# Altium schematic sheet PowerDACSUB (2).SchDoc
size Legal; SheetNumber: 2; SheetTotal: 5
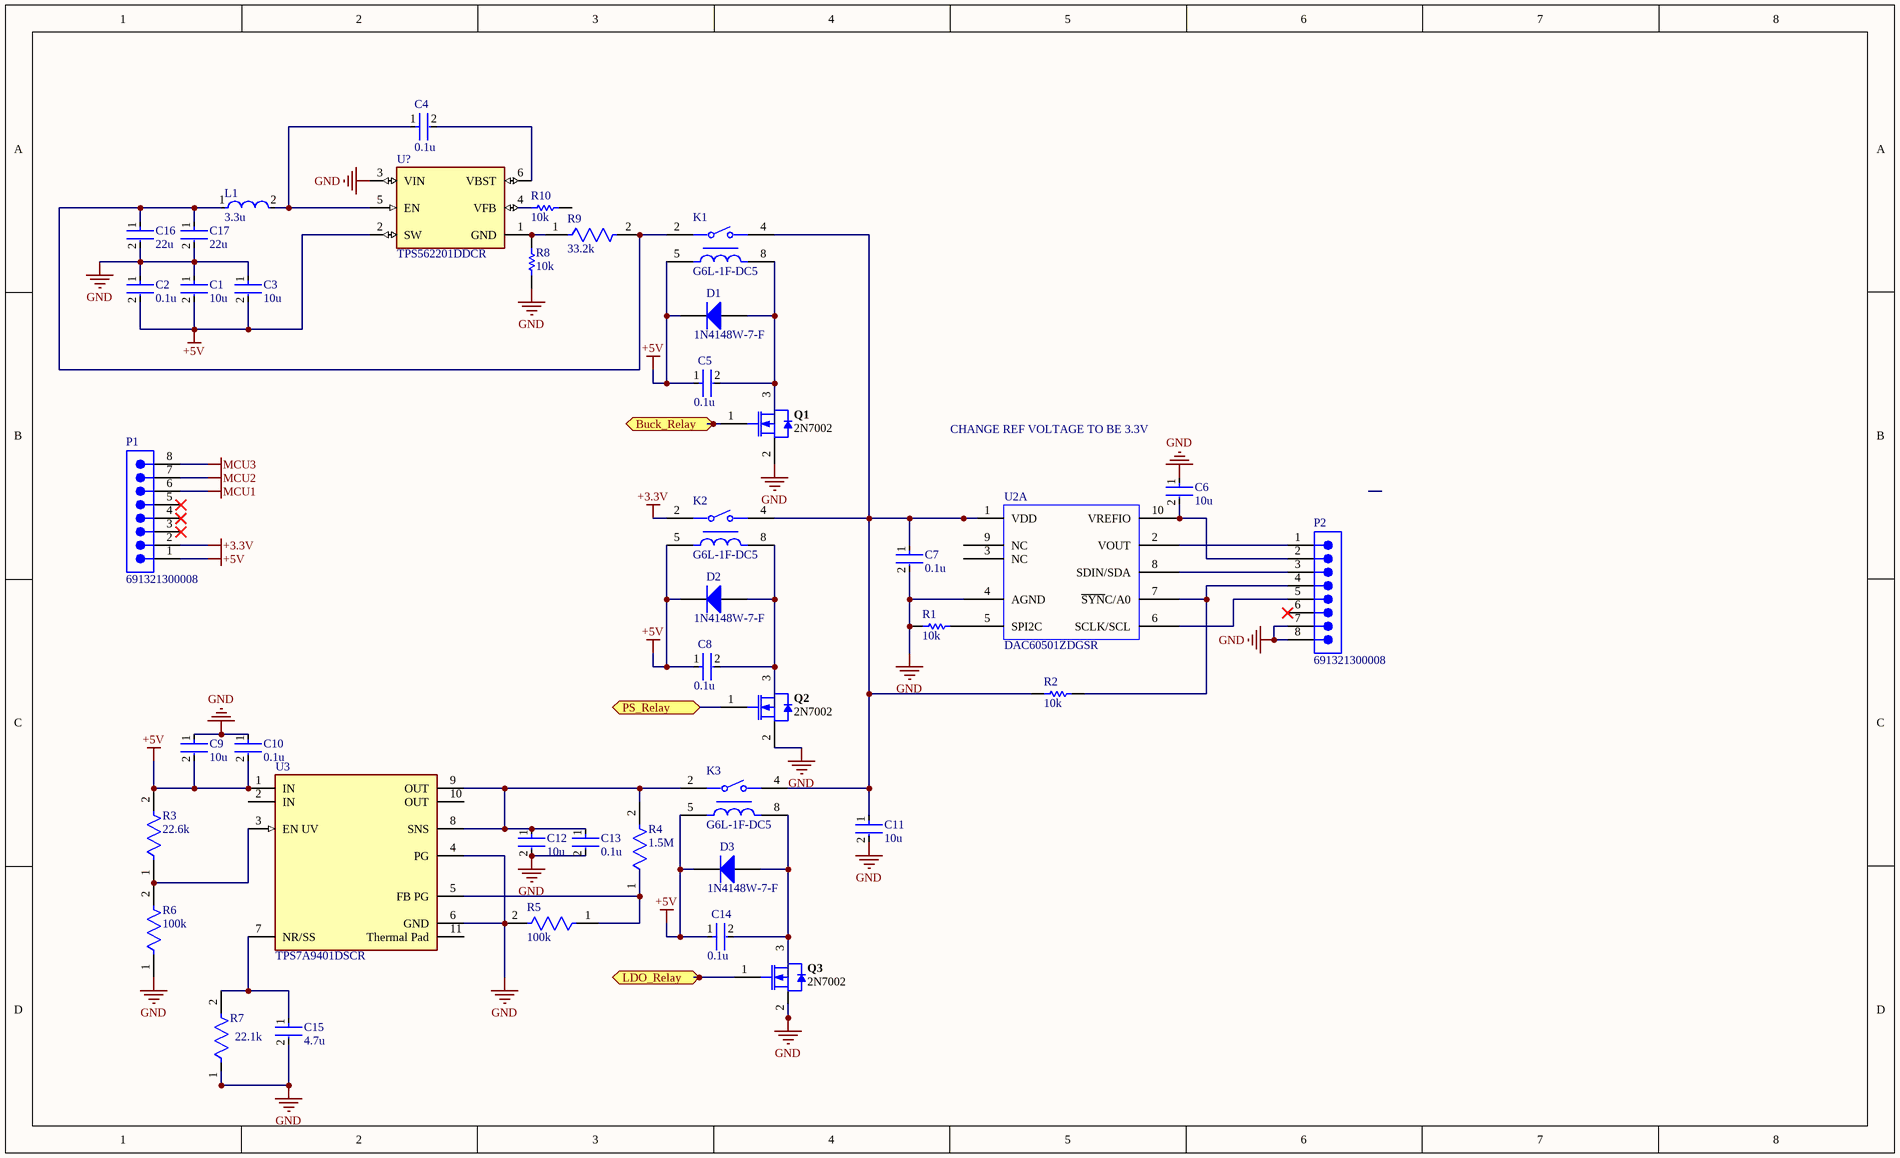
[diagram p0: PowerDACSUB (2).SchDoc]

## Parts
C1  10u  [FP-CL21-IPC_A]
C2  0.1u  [FP-CC0805-0_85-MFG]
C3  10u  [FP-CL21-IPC_A]
C4  0.1u  [FP-CC0805-0_85-MFG]
C5  0.1u  [FP-CC0805-0_85-MFG]
C6  10u  [FP-CL21-IPC_A]
C7  0.1u  [FP-CC0805-0_85-MFG]
C8  0.1u  [FP-CC0805-0_85-MFG]
C9  10u  [FP-CL21-IPC_A]
C10  0.1u  [FP-CC0805-0_85-MFG]
C11  10u  [FP-CL21-IPC_C]
C12  10u  [FP-CL21-IPC_A]
C13  0.1u  [FP-CC0805-0_85-MFG]
C14  0.1u  [FP-CC0805-0_85-MFG]
C15  4.7u  [FP-CL21-IPC_A]
C16  22u  [FP-CL32-IPC_C]
C17  22u  [FP-CL32-IPC_C]
D1  1N4148W-7-F  [DIOD-SOD123-2_V]
D2  1N4148W-7-F  [DIOD-SOD123-2_V]
D3  1N4148W-7-F  [DIOD-SOD123-2_V]
K1  G6L-1F-DC5  [FP-G6L-1F-DC5-MFG]
K2  G6L-1F-DC5  [FP-G6L-1F-DC5-MFG]
K3  G6L-1F-DC5  [FP-G6L-1F-DC5-MFG]
L1  3.3u  [FP-NR4018-MFG]
P1  691321300008  [691321300008]
P2  691321300008  [691321300008]
Q1  2N7002  [INF-PG-SOT23_M]
Q2  2N7002  [INF-PG-SOT23_M]
Q3  2N7002  [INF-PG-SOT23_M]
R1  10k  [RESC1609X50X30ML10T20]
R2  10k  [RESC1609X50X30ML10T20]
R3  22.6k  [FP-RT0805-MFG]
R4  1.5M  [FP-MCR03-IPC_B]
R5  100k  [FP-RK73H1J-IPC_C]
R6  100k  [FP-RK73H1J-IPC_C]
R7  22.1k  [FP-CRCW0805-e3-IPC_C]
R8  10k  [RESC1609X50X30ML10T20]
R9  33.2k  [FP-CR0805-IPC_C]
R10  10k  [RESC1609X50X30ML10T20]
U2  DAC60501ZDGSR  [DAC60501ZDSGR]  (part A of 2)
U3  TPS7A9401DSCR  [FP-DSC0010J-MFG]
U?  TPS562201DDCR  [FP-DDC0006A-IPC_C]

## Ports
Buck_Relay (bidir), LDO_Relay (bidir), PS_Relay (bidir)

## Nets
+3.3V: K2.2 P1.2
+5V: C1.2 C2.2 C3.2 C5.1 C8.1 C9.2 C10.2 C14.1 D1.2(K) D2.2(K) D3.2(K) K1.5 K2.5 K3.5 P1.1 R3.2 U3.1(IN) U?.2(SW)
GND: C1.1 C2.1 C3.1 C6.1 C7.2 C9.1 C10.1 C11.2 C12.2 C13.2 C15.2 C16.2 C17.2 P2.7 P2.8 Q1.2(SOURCE) Q2.2(SOURCE) Q3.2(SOURCE) R1.1 R5.2 R6.1 R7.1 R8.1 U2.4(AGND) U3.4(PG) U3.6(GND) U?.3(VIN)
MCU1: P1.6
MCU2: P1.7
MCU3: P1.8
Buck_Relay: Q1.1(GATE) ; port Buck_Relay
LDO_Relay: Q3.1(GATE) ; port LDO_Relay
PS_Relay: Q2.1(GATE) ; port PS_Relay
NetC4_1: C4.1 L1.2 U?.5(EN)
NetC4_2: C4.2 U?.6(VBST)
NetC5_2: C5.2 D1.1(A) K1.8 Q1.3(DRAIN)
NetC6_2: C6.2 P2.2 U2.10(VREFIO)
NetC7_1: C7.1 C11.1 K1.4 K2.4 K3.4 R2.1 U2.1(VDD)
NetC8_2: C8.2 D2.1(A) K2.8 Q2.3(DRAIN)
NetC12_1: C12.1 C13.1 K3.2 R4.2 U3.8(SNS) U3.9(OUT)
NetC14_2: C14.2 D3.1(A) K3.8 Q3.3(DRAIN)
NetC15_1: C15.1 R7.2 U3.7(NR/SS)
NetC16_1: C16.1 C17.1 K1.2 L1.1 R9.2
NetP2_1: P2.1 U2.2(VOUT)
NetP2_3: P2.3 U2.8(SDIN/SDA)
NetP2_4: P2.4 R2.2 U2.7(~{SYN}C/A0)
NetP2_5: P2.5 U2.6(SCLK/SCL)
NetR1_2: R1.2 U2.5(SPI2C)
NetR3_1: R3.1 R6.2 U3.3(EN_UV)
NetR4_1: R4.1 R5.1 U3.5(FB_PG)
NetR8_2: R8.2 R9.1 U?.1(GND)
NetR10_2: R10.2 U?.4(VFB)

Not connected (* = marked no-connect by the designer): P1 3* 4* 5*; P2 6*; R10 1; U2 3(NC) 9(NC); U3 2(IN) 10(OUT) 11(Thermal_Pad)

## Notes on the sheet
- CHANGE REF VOLTAGE TO BE 3.3V

## Library data of the parts
C1 C3 C6 C9 C12 = CMP-13271-002172-1: CL21 Series 0805 10uF 25V ±10% Tolerance X5R Multilayer Ceramic Chip Capacitor; Width: 0.049inch; Voltage Rating: 25V; Case/Package: 0805; Case Code (Imperial): 0805; Depth: 1.25mm; Capacitance: 10uF; Dielectric: X5R; Height: 0.85mm; Radiation Hardening: No; Thickness: 0.037inch; Length: 2mm; Packaging: Tape and Reel; Min Operating Temperature: -55°C; Case Code (Metric): 2012; Lead Free: Lead Free; Mount: Surface Mount; Package Quantity: 1; Tolerance: 10%; Max Operating Temperature: 85°C
C2 C4 C5 C8 C14 = CMP-2100-03606-3: Manufacturer Part Number: CC0805KRX7R9BB104; Manufacturer: Yageo; Tolerance: 0.1; Capacitance: 100 nF; Value: 100 nF; Temperature Characteristic: X7R; Voltage Rating: 50 V; Material: Ceramic; Device Class L1: Passive Components; ComponentLink2Description: Datasheet; Package: CC0805-0.85; Digikey Description: CAP CER 0.1UF 50V X7R 0805; Device Class L3: Ceramic Capacitors; Temperature: -30°C to +85°C; Height: 0.95mm; RoHS: TRUE; Ipc Land Pattern Name: CAPC200125X85; Device Class L2: Capacitors; Category: Cap; Temperature Range Low: -30°C; Temperature Range High: +85°C; Mouser Description: Multilayer Ceramic Capacitors MLCC - SMD/SMT 100nF 50V X7R 10%; Footprint Url: http://www.yageo.com/exep/pages/download/literatures/UPY-C_GEN_24.pdf; Automotive: No; Octopart: https://octopart.com/cc0805krx7r9bb104-yageo-192993; Lead Free: Yes; ComponentLink2URL: http://www.yageo.com/documents/recent/UPY-GPHC_Y5V_6.3V-to-50V_8.pdf
C7 C10 C13 = CMP-2100-03606-3: CAP CER 0.1UF 50V X7R 0805; Manufacturer Part Number: CC0805KRX7R9BB104; Manufacturer: Yageo; Tolerance: 0.1; Capacitance: 100 nF; Value: 100 nF; Material: Ceramic; Device Class L1: Passive Components; ComponentLink2Description: Datasheet; Package: CC0805-0.85; Digikey Description: CAP CER 0.1UF 50V X7R 0805; Device Class L3: Ceramic Capacitors; Temperature: -30°C to +85°C; Temperature Characteristic: X7R; Voltage Rating: 50 V; Height: 0.95mm; RoHS: TRUE; Ipc Land Pattern Name: CAPC200125X85; Device Class L2: Capacitors; Category: Cap; Temperature Range Low: -30°C; Temperature Range High: +85°C; Mouser Description: Multilayer Ceramic Capacitors MLCC - SMD/SMT 100nF 50V X7R 10%; Footprint Url: http://www.yageo.com/exep/pages/download/literatures/UPY-C_GEN_24.pdf; Automotive: No; Octopart: https://octopart.com/cc0805krx7r9bb104-yageo-192993; Lead Free: Yes; ComponentLink2URL: http://www.yageo.com/documents/recent/UPY-GPHC_Y5V_6.3V-to-50V_8.pdf
C11 = CMP-13271-002245-1: CL21 Series 0805 10uF 10V ±20% Tolerance X5R Multilayer Ceramic Chip Capacitor; Voltage Rating (DC): 10V; Mount: Surface Mount; Tolerance: 20%; Case/Package: 0805; Voltage Rating: 10V; Dielectric: X5R; Max Operating Temperature: 85°C; Packaging: Tape and Reel; Capacitance: 10uF; Height: 1.25mm; Thickness: 0.053inch; Width: 0.049inch; Length: 2mm; Radiation Hardening: No; Min Operating Temperature: -55°C; Depth: 1.25mm; Package Quantity: 10000
C15 = CMP-13271-002624-1: CL21 Series 0805 4.7uF 25V ±10% Tolerance X5R Multilayer Ceramic Chip Capacitor; Case Code (Imperial): 0805; Thickness: 0.055inch; Mount: Surface Mount; Case Code (Metric): 2012; Capacitance: 4.7uF; Depth: 1.25mm; Lead Free: Lead Free; Case/Package: 0805; Voltage Rating: 25V; Package Quantity: 1; Width: 0.049inch; Radiation Hardening: No; Voltage Rating (DC): 25V; Length: 2mm; Dielectric: X5R; Height: 1.25mm; Packaging: Tape and Reel; Tolerance: 10%; Min Operating Temperature: -55°C; Max Operating Temperature: 85°C
C16 C17 = CMP-13271-003500-1: Cap Ceramic 22uF 16V X7R ±10% SMD 1210 +125°C Embossed T/R; Voltage: 10V; Lead Free: Lead Free; Max Operating Temperature: 125°C; Width: 0.098inch; Min Operating Temperature: -55°C; Height: 2.5mm; Tolerance: 10%; Voltage Rating (DC): 16V; Radiation Hardening: No; Case Code (Imperial): 1210; Thickness: 0.106inch; Material: Ceramic; Capacitance: 22uF; Package Quantity: 1; Length: 3.2mm; Depth: 2.5mm; Case/Package: 1210; Voltage Rating: 16V; Mount: Surface Mount; Case Code (Metric): 3225; Packaging: Tape and Reel; Dielectric: X7R
D1-D3 = CMP-2000-04932-2: Fast Switching Diode, 100 V, 0.15 A, -65 to 150 degC, 2-Pin?SOD123, RoHS, Tape and Reel; Recovery Time: 4ns; Brand: DiodesIncorporated; Unit Weight: 0.000353oz; Max Surge Current: 2A; Peak Reverse Voltage: 100V; Ir - Reverse Current: 1uA; Vf - Forward Voltage: 1.25V; Configuration: Single; If - Forward Current: 0.15A; Product Category: Diodes-GeneralPurpose,Power,Switching; Operating Temperature Range: -65Cto+150C; Packaging: Reel; Manufacturer URL: http://www.diodes.com/; Maximum Operating Temperature: +150C; Height: 1.25mm; Minimum Operating Temperature: -65C; Product: SwitchingDiodes; Package URL: http://www.diodes.com/datasheets/ds18004.pdf; Type: SwitchingDiode; Package Reference: SOD123-2; Width: 1.7mm; Datasheet URL: http://www.farnell.com/datasheets/1915529.pdf; Datasheet Version: Rev. 24-2, 10/2013; Series: 1N4148; Factory Pack Quantity: 3000; Length: 2.85mm; RoHS: True; Manufacturer: DiodesIncorporated; Mounting Style: SMD/SMT; Package / Case: SOD-123
K1-K3 = CMP-08823-000020-1: RELAY TELECOM SPST 1A 5VDC; Manufacturer: Omron; Standoff Height: 0.4mm; Throw Configuration: SPST-NO; Coil Type: Non-Latching; Coil Current: 36mA; Coil Resistance: 139Ω; Number Of Contacts: 1; Coil Voltage: 5V; Coil Power: 180mW; Device Class L3: Signal Relays; Automotive: No; ComponentLink2URL: https://media.digikey.com/pdf/Data%20Sheets/Omron%20PDFs/G6L.pdf; Ambient Temperature Range High: +70°C; Mouser Description: Low Signal Relays - PCB LO PROF SPST 5VDC; RoHS: TRUE; Temperature Range High: +70°C; Height: 4.4mm; Device Class L1: Electromechanical; Lead Free: Yes; Temperature: -40°C to +70°C; Device Class L2: Relays; Manufacturer Part Number: G6L-1F-DC5; Temperature Range Low: -40°C; Category: Relay; Octopart: https://octopart.com/g6l-1f+dc5-omron-18903080; Ambient Temperature Range Low: -40°C; Current Rating: 1A; Package: G6L-1F-DC5; Digikey Description: RELAY TELECOM SPST 1A 5VDC; ComponentLink2Description: Datasheet
L1 = CMP-14484-000015-2: SMD Power Inductors 3.3uH ±20% 2A 66mΩ; Self Resonant Frequency: 45MHz; Saturation Current: 2.3A; Test Frequency: 100kHz; DC Resistance (DCR): 66mR; Shielding: Shielded; Core Material: Ferrite; Packaging: Tape and Reel; Resistor Type: Wirewound; Inductance Tolerance: 20%; Width: 0.157inch; Depth: 4.2mm; Lead Pitch: 2.8mm; RoHS Compliant: Yes; Max DC Current: 2.3A; Inductance: 3.3uH; Lead Free: Lead Free; Radiation Hardening: No; Halogen Free: Halogen Free; Termination: SMD/SMT; Height: 1.8mm; Number of Pins: 2; Case/Package: Nonstandard; Mount: Surface Mount; Tolerance: 20%; Max Operating Temperature: 125°C; Height - Seated (Max): 0.071inch; RMS Current (Irms): 2A; Length: 4mm; Series: NRS; Min Operating Temperature: -25°C; Package Quantity: 3500; Current Rating: 2A
P1 P2 = CMP-1502-01869-2: NexarPartId: 8917776; Number of Levels: 1; Voltage: 300V; Gender: Male; Number of Positions Per Level: 8; Pitch: 3.81mm; Current: 20A; Orientation: Vertical; Width: 35.38mm; Number of Pins: 8; Color: Green; Lead Pitch: 3.81mm; Termination: Solder; Contact Material: Brass; REACH SVHC: Unknown; RoHS: Compliant; Mount: Through Hole; Contact Plating: Tin; Length: 7mm; Number of Rows: 1; Number of Contacts: 8; Packaging: Box; Height: 12.7mm
Q1-Q3 = CMP-1149-00026-1: N-Channel OptiMOS Small-Signal-Transistor, 60 V VDS, 0.3 A ID, -55 to 150 degC, PG-SOT23, Reel, Green; Manufacturer: Infineon; RDS (on) (max) (@4.5V): 4,000 mOhm; VDS (max): 60 V; IDpuls (max): 1.2Â A; QG: 0.4Â nC; RDS (on) (max): 3,000 mOhm; RthJA (max): 250 K/W; ID (max): 0.3Â A; VGS(th) (max): 2.5Â V; VGS(th) (min): 1.5Â V; Green: TRUE; Ptot (max): 0.5Â W; PackageDescription: 3-Pin Small Outline Transistor Package, 2.9 x 1.3 mm Body, 0.95 mm Pitch; Halogen-free: TRUE; ComponentLink2Description: Datasheet; ComponentLink1URL: http://www.infineon.com/; Packing: Reel; DatasheetVersion: Rev. 2.4; PartNumber: 2N7002; PackageReference: PG-SOT23; PackageVersion: Apr-08; ComponentLink3URL: http://www.infineon.com/dgdl/SOT23-Package_Overview.pdf?folderId=db3a30431936bc4b0119532290053c66&fileId=db3a30431936bc4b0119533468123c85; ComponentLink1Description: Manufacturer URL; Mounting Technology: Surface Mount; ComponentLink3Description: Package Specification; ComponentLink2URL: http://www.infineon.com/dgdl/2N7002_Rev2.4.pdf?folderId=db3a3043156fd573011622e10b5c1f67&fileId=db3a304319bc939a0119c2a9461e79e6
R1 R2 R8 R10 = CMP-2000-03837-1: Manufacturer: Vishay Dale; Part Number: CRCW060310K0FKTB
R3 = CMP-2001-01789-2: RES SMD 22.6K OHM 1% 1/8W 0805; Manufacturer: Yageo; Manufacturer Part Number: RT0805FRE0722K6L; Power Rating: 0.125W; Tolerance: 0.0001; Voltage Rating: 150V; Value: 22.6KΩ; Temperature Coefficient: 50 ppm/°C; Device Class L3: Chip SMD Resistors; Octopart: https://octopart.com/rt0805fre0722k6l-yageo-1479006; Series: RT; Lead Free: Yes; Digikey Description: RES SMD 22.6K OHM 1% 1/8W 0805; Automotive: No; Ipc Land Pattern Name: RESC200125X50; RoHS: TRUE; Category: Res; ComponentLink2Description: Datasheet; Composition: Thin Film; Device Class L2: Resistors; Temperature: -55°C to +155°C; Resistance: 22.6KΩ; Temperature Range High: +155°C; Device Class L1: Passive Components; Mouser Description: Thin Film Resistors - SMD 1/8W 22.6K ohm 1% 50ppm; Temperature Range Low: -55°C; Package: RT0805; Height: 0.6mm; Footprint Url: http://www.yageo.com/exep/pages/download/literatures/PYu-R_Mount_10.pdf; ComponentLink2URL: http://www.yageo.com/documents/recent/PYu-RT_1-to-0.01_RoHS_L_9.pdf
R4 = CMP-08839-027182-1: Thick Film Chip Resistor, 0603, 1.5MΩ, 1%, 100ppm/°C, 0.1W, 50V; Max Power Dissipation: 100mW; Resistance: 1.5MR; Length: 0.063inch; Case Code (Metric): 1608; Case Code (Imperial): 0603; Width: 0.031inch; Tolerance: 1%; Temperature Coefficient: 100ppm/°C; Voltage Rating (DC): 50V; Max Operating Temperature: 155°C; Series: MCR03; Packaging: Tape and Reel; Number of Terminations: 2; Min Operating Temperature: -55°C; Resistor Type: Thick Film; Case/Package: 0603; RoHS Compliant: Yes; Package Quantity: 5000; Height: 0.022inch
R5 R6 = CMP-04015-074272-1: 100kΩ ±1% 0.1W Chip Resistor 0603 Thick Film AEC-Q200 Qualified; Temperature Coefficient: 100ppm/°C; Power Rating: 100mW; Voltage Rating: 50V; Resistance: 100kR; Series: RK73H; Case/Package: 0603; Max Operating Temperature: 155°C; Case Code (Imperial): 0603; Length: 1.6mm; Package Quantity: 5000; Min Operating Temperature: -55°C; Tolerance: 1%; Termination: SMD/SMT; Packaging: Tape and Reel; Case Code (Metric): 1608; Height: 0.45mm; Width: 0.8mm; Lead Free: Contains Lead
R7 = CMP-2001-03689-2: RES Thick Film, 22.1kΩ, 1%, 0.125W, 100ppm/°C, 0805; Voltage Rating (DC): 150V; Max Power Dissipation: 125mW; Resistance: 22.1kR; Voltage Rating: 150V; Height: 0.45mm; Packaging: Tape and Reel; Lead Free: Lead Free; Composition: Thick Film; Temperature Coefficient: 100ppm/°C; Depth: 1.25mm; Length: 2mm; Case Code (Metric): 2012; Number of Terminations: 2; Case/Package: 0805; Termination: SMD/SMT; Power Rating: 125mW; Package Quantity: 10; Max Operating Temperature: 155°C; Radiation Hardening: No; Width: 1.25mm; Military Standard: Not; Weight: 0.000194oz; Contact Plating: Tin; Min Operating Temperature: -55°C; Features: Automotive AEC-Q200; Case Code (Imperial): 0805; Tolerance: 1%
R9 = CMP-07231-003068-1: Thick Film Chip Resistors 0805 33.2kΩ 0.125W 1% 100ppm/°C; Power Rating: 125mW; Resistance: 33.2kR; Voltage Rating: 150V; Termination: SMD/SMT; Number of Terminations: 2; Case/Package: 0805; Packaging: Tape and Reel; Min Operating Temperature: -55°C; Height: 0.024inch; Depth: 1.25mm; Package Quantity: 1; Width: 0.049inch; Features: Moisture Resistant; Max Power Dissipation: 125mW; Max Operating Temperature: 155°C; Case Code (Metric): 2012; Temperature Coefficient: 100ppm/°C; Tolerance: 1%; Military Standard: Not; Length: 2mm; Case Code (Imperial): 0805; Radiation Hardening: No; Contact Plating: Tin; Thickness: 508um; Composition: Thick Film; Mount: Surface Mount
U3 = CMP-04917-000380-1: 1-A, ULTRA-LOW NOISE, ULTRA-HIGH
U? = CMP-04918-000361-1: IC REG BUCK ADJ 2A TSOT23-6; Switching Frequency: 580kHz; Max Input Voltage: 17V; Number of Outputs: 1; Output Voltage: 7V; Output Type: Adjustable; Quiescent Current: 400uA; Min Input Voltage: 4.5V; Mount: Surface Mount; Max Operating Temperature: 125°C; Lead Free: Lead Free; Operating Supply Voltage: 17V; Number of Pins: 6; RoHS Compliant: Yes; Contact Plating: Tin; Min Operating Temperature: -40°C; Case/Package: SOT; Max Output Current: 2A